# Altium project XP-Hardv.PrjPCB
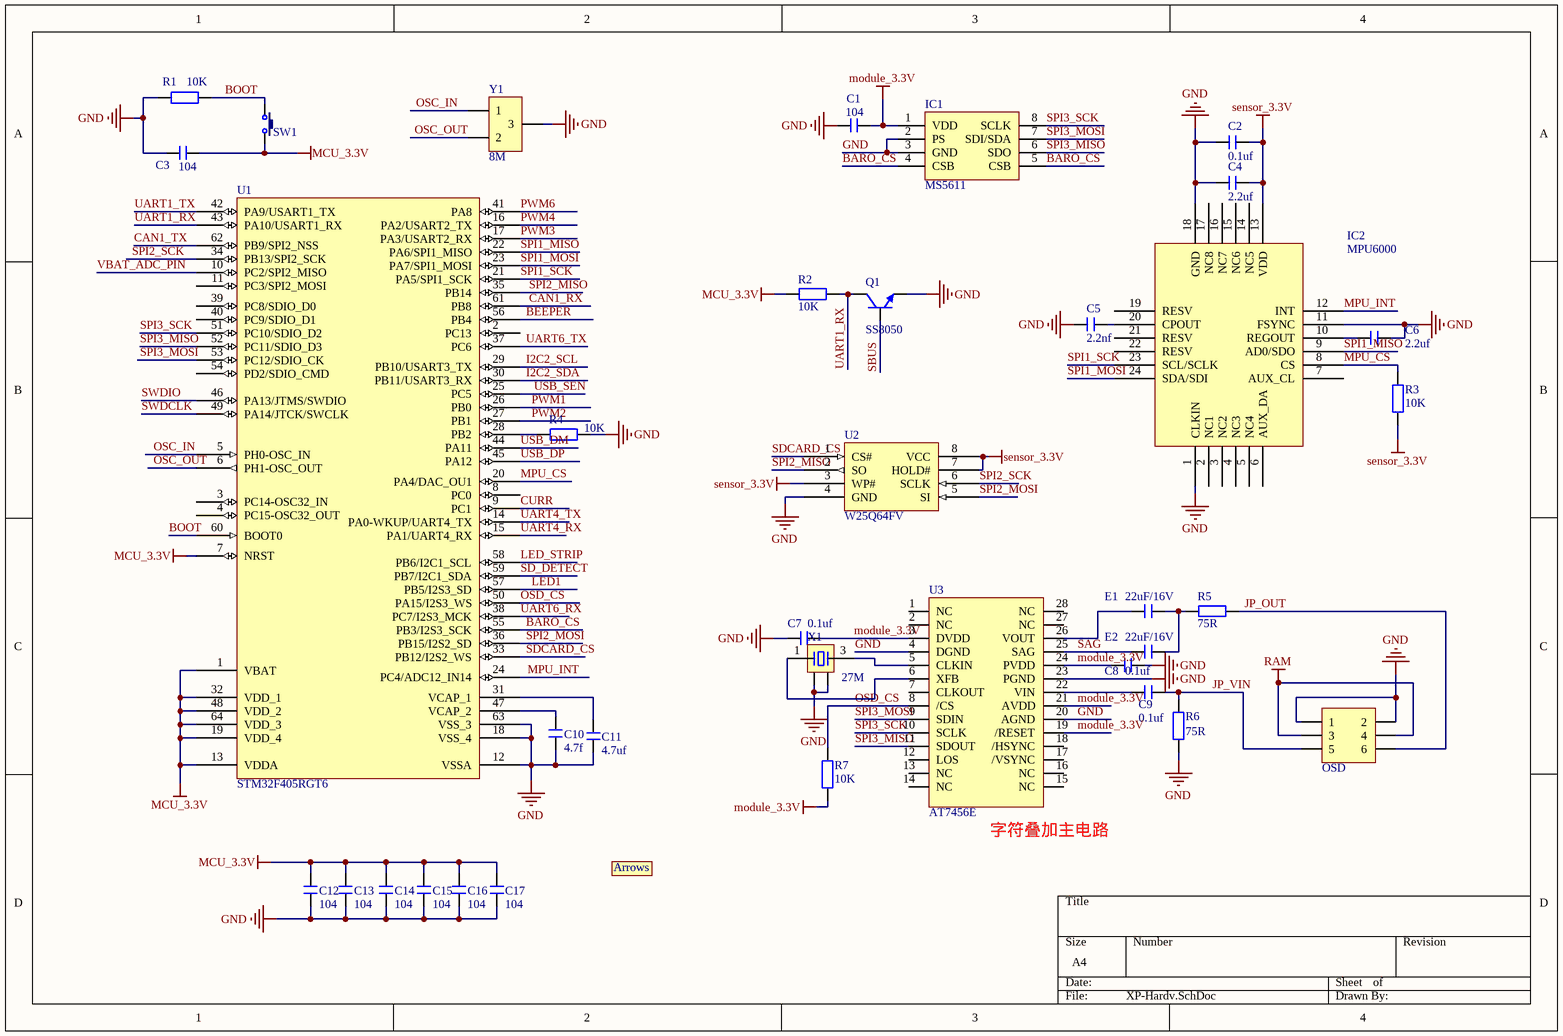
[diagram p0: XP-Hardv.SchDoc]
2 sheets, 87 parts. Net scope: global (net labels, ports and power ports of the same name join across sheets).
Board file: XP-Hardv.PcbDoc
Sheets:
  XP-Hardv.SchDoc
  XP-Hardv_PMU.SchDoc

## Sheet XP-Hardv.SchDoc
size A4

### Parts
C1  104  [C 0402_M]
C2  0.1uf  [C 0402_M]
C3  104  [C 0402_M]
C4  2.2uf  [C 0402_M]
C5  2.2nf  [C 0402_M]
C6  2.2uf  [C 0402_M]
C7  0.1uf  [C 0402_M]
C8  0.1uf  [C 0402_M]
C9  0.1uf  [C 0402_M]
C10  4.7f  [C 0402_M]
C11  4.7uf  [C 0402_M]
C12  104  [C 0402_M]
C13  104  [C 0402_M]
C14  104  [C 0402_M]
C15  104  [C 0402_M]
C16  104  [C 0402_M]
C17  104  [C 0402_M]
E1  22uF/16V  [C 0805_L]
E2  22uF/16V  [C 0805_L]
IC1  MS5611  [MS5611]
IC2  MPU6000  [MPU6050]
logo1  Arrows  [Arrows - E]  (value not drawn)
OSD  Header3X2  [PHD2.0-LI-2x3P]  (value not drawn)
Q1  SS8050  [SOT23-3M]
R1  10K  [R 0402_M]
R2  10K  [R 0402_M]
R3  10K  [R 0402_M]
R4  10K  [R 0402_M]
R5  75R  [R 0402_M]
R6  75R  [R 0402_M]
R7  10K  [R 0402_M]
SW1  3x6x5  [TSW 3*6*4.3-S-W]  (value not drawn)
U1  STM32F405RGT6  [LQFP64 10x10_N]
U2  W25Q64FV  [Q-WSON8_6x5]
U3  AT7456E  [AT7456E - B]
X1  27M  [OSC 3225-4P]
Y1  8M  [L - CSTCE-3213]

### Nets
CAN1_RX: U1.61(PB8)
CAN1_TX: U1.62(PB9/SPI2_NSS)
GND: C1.2 C2.2 C3.1 C4.2 C5.2 C6.1 C7.1 C8.2 C10.1 C11.1 C12.1 C13.1 C14.1 C15.1 C16.1 C17.1 IC1.2(PS) IC1.3(GND) IC2.1(CLKIN) IC2.11(FSYNC) IC2.18(GND) OSD.1 OSD.2 Q1.2(E) R1.2 R4.2 R6.1 U1.12(VSSA) U1.18(VSS_4) U1.63(VSS_3) U2.4(GND) U3.4(DGND) U3.20(AGND) U3.23(PGND) X1.2 X1.4 Y1.3
MCU_3.3V: C3.2 C12.2 C13.2 C14.2 C15.2 C16.2 C17.2 R2.2 SW1.2 U1.1(VBAT) U1.7(NRST) U1.13(VDDA) U1.19(VDD_4) U1.32(VDD_1) U1.48(VDD_2) U1.64(VDD_3)
module_3.3V: C1.1 C7.2 C8.1 IC1.1(VDD) R7.1 U3.3(DVDD) U3.19(/RESET) U3.21(AVDD) U3.24(PVDD)
RAM: OSD.3 OSD.4
sensor_3.3V: C2.1 C4.1 IC2.13(VDD) R3.1 U2.3(WP#) U2.7(HOLD#) U2.8(VCC)
BARO_CS: IC1.4(CSB) IC1.5(CSB) U1.55(PB3/I2S3_SCK)
BEEPER: U1.56(PB4)
BOOT: R1.1 SW1.1 U1.60(BOOT0)
CURR: U1.9(PC1)
I2C2_SCL: U1.29(PB10/USART3_TX)
I2C2_SDA: U1.30(PB11/USART3_RX)
JP_OUT: OSD.6 R5.2
JP_VIN: C9.2 OSD.5 R6.2
LED1: U1.57(PB5/I2S3_SD)
LED_STRIP: U1.58(PB6/I2C1_SCL)
MPU_CS: IC2.8(CS) R3.2 U1.20(PA4/DAC_OU1)
MPU_INT: IC2.12(INT) U1.24(PC4/ADC12_IN14)
OSC_IN: U1.5(PH0-OSC_IN) Y1.1
OSC_OUT: U1.6(PH1-OSC_OUT) Y1.2
OSD_CS: R7.2 U1.50(PA15/I2S3_WS) U3.8(/CS)
PWM1: U1.26(PB0)
PWM2: U1.27(PB1)
PWM3: U1.17(PA3/USART2_RX)
PWM4: U1.16(PA2/USART2_TX)
PWM6: U1.41(PA8)
SAG: E2.1 U3.25(SAG)
SBUS: Q1.1(B)
SD_DETECT: U1.59(PB7/I2C1_SDA)
SDCARD_CS: U1.33(PB12/I2S2_WS) U2.1(CS#)
SPI1_MISO: IC2.9(AD0/SDO) U1.22(PA6/SPI1_MISO)
SPI1_MOSI: IC2.24(SDA/SDI) U1.23(PA7/SPI1_MOSI)
SPI1_SCK: IC2.23(SCL/SCLK) U1.21(PA5/SPI1_SCK)
SPI2_MISO: U1.35(PB14) U2.2(SO)
SPI2_MOSI: U1.36(PB15/I2S2_SD) U2.5(SI)
SPI2_SCK: U1.34(PB13/SPI2_SCK) U2.6(SCLK)
SPI3_MISO: IC1.6(SDO) U1.52(PC11/SDIO_D3) U3.11(SDOUT)
SPI3_MOSI: IC1.7(SDI/SDA) U1.53(PC12/SDIO_CK) U3.9(SDIN)
SPI3_SCK: IC1.8(SCLK) U1.51(PC10/SDIO_D2) U3.10(SCLK)
SWDCLK: U1.49(PA14/JTCK/SWCLK)
SWDIO: U1.46(PA13/JTMS/SWDIO)
UART1_RX: Q1.3(C) R2.1 U1.43(PA10/USART1_RX)
UART1_TX: U1.42(PA9/USART1_TX)
UART4_RX: U1.15(PA1/UART4_RX)
UART4_TX: U1.14(PA0-WKUP/UART4_TX)
UART6_RX: U1.38(PC7/I2S3_MCK)
UART6_TX: U1.37(PC6)
USB_DM: U1.44(PA11)
USB_DP: U1.45(PA12)
USB_SEN: U1.25(PC5)
VBAT_ADC_PIN: U1.10(PC2/SPI2_MISO)
NetC5_1: C5.1 IC2.20(CPOUT)
NetC6_2: C6.2 IC2.10(REGOUT)
NetC9_1: C9.1 U3.22(VIN)
NetC10_2: C10.2 U1.47(VCAP_2)
NetC11_2: C11.2 U1.31(VCAP_1)
NetE1_1: E1.1 U3.26(VOUT)
NetE1_2: E1.2 E2.2 R5.1
NetR4_1: R4.1 U1.28(PB2)
NetU3_5: U3.5(CLKIN) X1.3
NetU3_6: U3.6(XFB) X1.1

Not connected (* = marked no-connect by the designer): IC2 2(NC1) 3(NC2) 4(NC3) 5(NC4) 6(AUX_DA) 7(AUX_CL) 14(NC5) 15(NC6) 16(NC7) 17(NC8) 19(RESV) 21(RESV) 22(RESV); U1 2(PC13) 3(PC14-OSC32_IN) 4(PC15-OSC32_OUT) 8(PC0) 11(PC3/SPI2_MOSI) 39(PC8/SDIO_D0) 40(PC9/SDIO_D1) 54(PD2/SDIO_CMD); U3 1(NC) 2(NC) 7(CLKOUT) 12(LOS) 13(NC) 14(NC) 15(NC) 16(NC) 17(/VSYNC) 18(/HSYNC) 27(NC) 28(NC)

### Notes on the sheet
- Labels drawn without touching a wire or pin: 字符叠加主电路

### Library data of the parts
C1-C17 E1 E2 = C: 无极性贴片电容; 版权归属: 源创客; BOM名称: 无极性贴片电容; 学习资源: www.ooocke.com
IC1 = MS5611: 气压传感器; 版权归属: 源创客; BOM名称: 气压传感器; 学习资源: www.ooocke.com
IC2 = MPU6000: 版权所有: 河池学院智能控制重点实验室; Library name: 传感器; 了解我们: http://www.jianshengdrlab.com
logo1 = Arrows: 名称: 箭头; 版权所有: 深圳市哈鸣科技有限公司; 说明: 无人机方向箭头
OSD = Header 3X2: 3*2P接插件; 版权归属: 源创客; BOM名称: 3*2P接插件; 学习资源: www.ooocke.com
Q1 = 8050-SMD: 高频放大-NPN型; 版权归属: 源创客; 属性: 40V 1.5A 1W 100MHZ; BOM名称: 高频放大-NPN型; 学习资源: www.ooocke.com
R1-R7 = R: 贴片电阻; 版权归属: 源创客; BOM名称: 贴片电阻; 学习资源: www.ooocke.com
SW1 = TSW 3x6: 3x6轻触开关; 版权归属: 源创客; BOM名称: 3x6轻触开关; 学习资源: www.ooocke.com
U1 = STM32F405RGT6: 32位STM单片机
U2 = W25Q64FV: 存储器芯片-64M
U3 = AT7456E: 版权所有: 河池学院智能控制重点实验室; Library name: 字符叠加芯片; 了解我们: http://www.jianshengdrlab.com
X1 = XTAL-4P: 4脚无源晶振; 版权归属: 源创客; BOM名称: 4脚无源晶振; 学习资源: www.ooocke.com
Y1 = CSTCE: BOM名称: 3脚无源晶振; 版权归属: Ly

## Sheet XP-Hardv_PMU.SchDoc
size A4
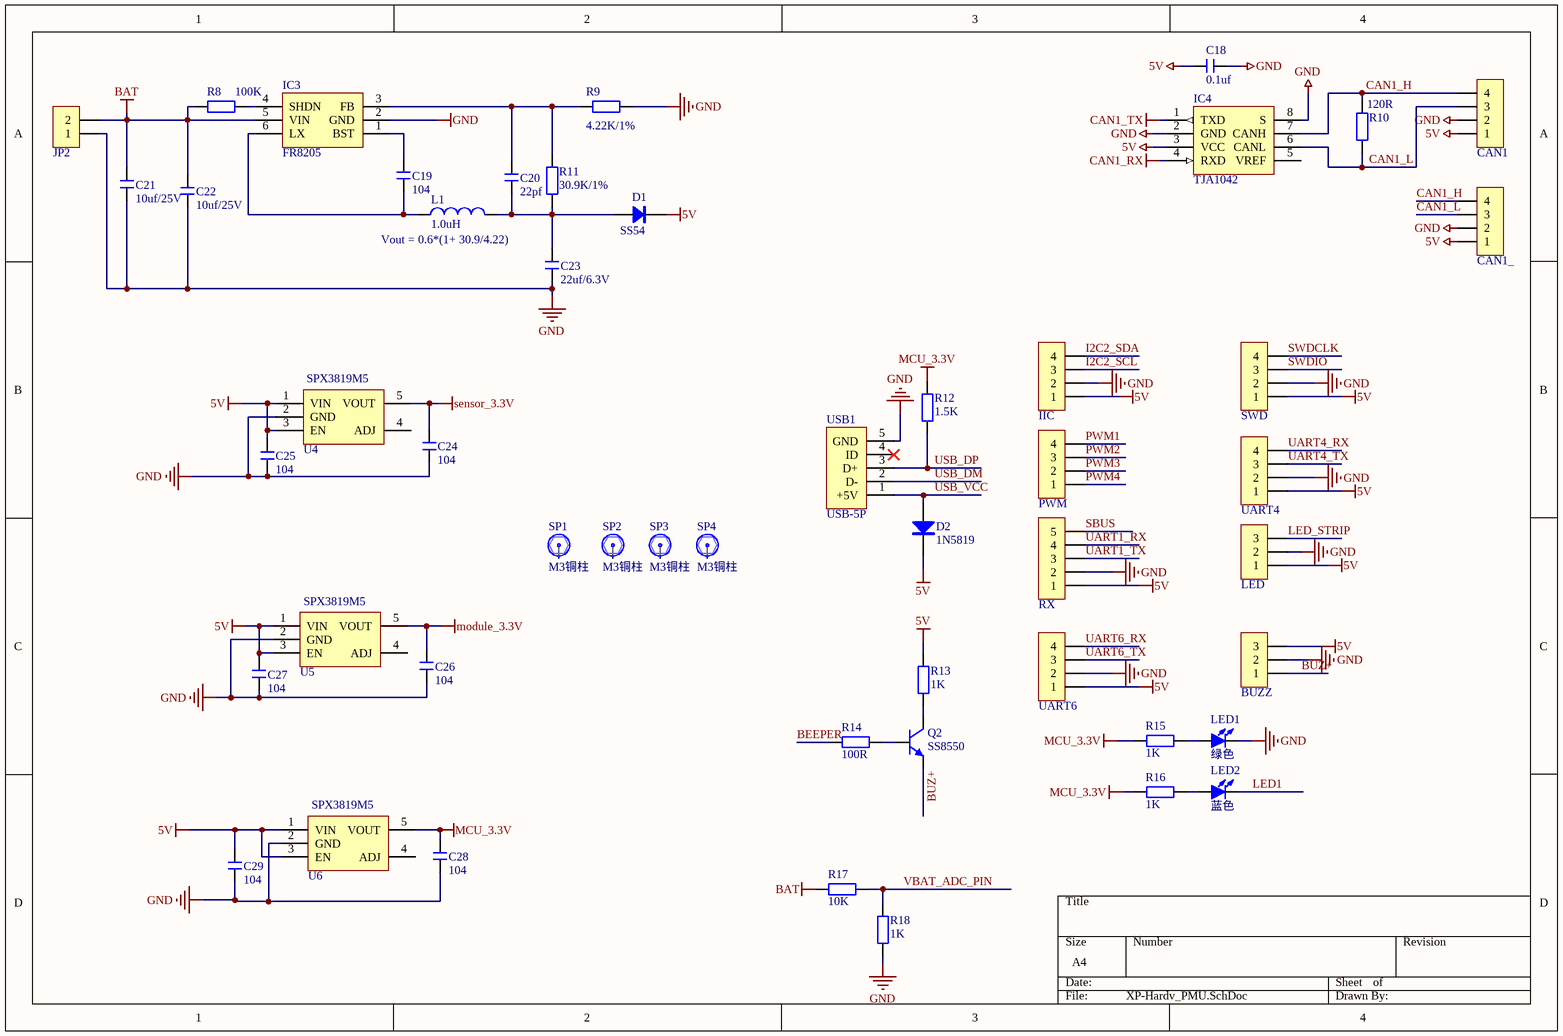
[diagram p1: XP-Hardv_PMU.SchDoc]

### Parts
BUZZ  Header 3  [SH1.00-WS-3P]  (value not drawn)
C18  0.1uf  [0402-C-1.6*0.5]
C19  104  [C 0402_M]
C20  22pf  [C 0402_M]
C21  10uf/25V  [C 0603_L]
C22  10uf/25V  [C 0603_L]
C23  22uf/6.3V  [C 0603_L]
C24  104  [C 0402_M]
C25  104  [C 0402_M]
C26  104  [C 0402_M]
C27  104  [C 0402_M]
C28  104  [C 0402_M]
C29  104  [C 0402_M]
CAN1  Header 4  [SH1.00-WS-4P]  (value not drawn)
CAN1_  Header 4  [SH1.00-WS-4P]  (value not drawn)
D1  SS54  [SMA]
D2  1N5819  [SOD-323]
IC3  FR8205  [SOT23-6L]
IC4  TJA1042  [L - HVSON - 8 - 3*3]
IIC  Header 4  [SH1.00-WS-4P]  (value not drawn)
JP2  HDR-1X2  [HDR2.54-LI-2P]  (value not drawn)
L1  1.0uH  [L - 7X7-F]
LED  Header 3  [SH1.00-WS-3P]  (value not drawn)
LED1  绿色  [LED 0603G]
LED2  蓝色  [LED 0603B]
PWM  Header 4  [SH1.00-WS-4P]  (value not drawn)
Q2  SS8550  [SOT23-3M]
R8  100K  [R 0402_M]
R9  4.22K/1%  [R 0402_M]
R10  120R  [0402-R-1.6*0.5]
R11  30.9K/1%  [R 0402_M]
R12  1.5K  [R 0402_M]
R13  1K  [R 0402_M]
R14  100R  [R 0402_M]
R15  1K  [R 0402_M]
R16  1K  [R 0402_M]
R17  10K  [R 0402_M]
R18  1K  [R 0402_M]
RX  Header 5  [SH1.00-WS-5P]  (value not drawn)
SP1  M3铜柱  [M3x4+6_L]
SP2  M3铜柱  [M3x4+6_L]
SP3  M3铜柱  [M3x4+6_L]
SP4  M3铜柱  [M3x4+6_L]
SWD  Header 4  [SH1.00-WS-4P]  (value not drawn)
U4  SPX3819M5  [L - SOT23-5L]
U5  SPX3819M5  [L - SOT23-5L]
U6  SPX3819M5  [L - SOT23-5L]
UART4  Header 4  [SH1.00-WS-4P]  (value not drawn)
UART6  Header 4  [SH1.00-WS-4P]  (value not drawn)
USB1  USB-5P  [USB-MICRO_D]

### Nets
5V: BUZZ.3 C18.1 C25.2 C27.2 C29.2 CAN1.1 CAN1_.1 D1.2(K) D2.2(K) IC4.3(VCC) IIC.1 LED.1 R13.2 RX.1 SWD.1 U4.1(VIN) U4.3(EN) U5.1(VIN) U5.3(EN) U6.1(VIN) U6.3(EN) UART4.1 UART6.1
BAT: C21.2 C22.2 IC3.5(VIN) JP2.2 R8.1 R17.1
CAN1_RX: IC4.4(RXD)
CAN1_TX: IC4.1(TXD)
GND: BUZZ.2 C18.2 C21.1 C22.1 C23.1 C24.1 C25.1 C26.1 C27.1 C28.1 C29.1 CAN1.2 CAN1_.2 IC3.2(GND) IC4.2(GND) IC4.8(S) IIC.2 JP2.1 LED.2 LED1.2(K) R9.2 R18.1 RX.2 SWD.2 U4.2(GND) U5.2(GND) U6.2(GND) UART4.2 UART6.2 USB1.5(GND)
MCU_3.3V: C28.2 R12.2 R15.2 R16.2 U6.5(VOUT)
module_3.3V: C26.2 U5.5(VOUT)
sensor_3.3V: C24.2 U4.5(VOUT)
BEEPER: R14.1
BUZ+: BUZZ.1 Q2.2(E)
CAN1_H: CAN1.4 CAN1_.4 IC4.7(CANH) R10.1
CAN1_L: CAN1.3 CAN1_.3 IC4.6(CANL) R10.2
I2C2_SCL: IIC.3
I2C2_SDA: IIC.4
LED1: LED2.2(K)
LED_STRIP: LED.3
PWM1: PWM.4
PWM2: PWM.3
PWM3: PWM.2
PWM4: PWM.1
SBUS: RX.5
SWDCLK: SWD.4
SWDIO: SWD.3
UART1_RX: RX.4
UART1_TX: RX.3
UART4_RX: UART4.4
UART4_TX: UART4.3
UART6_RX: UART6.4
UART6_TX: UART6.3
USB_DM: USB1.2(D-)
USB_DP: R12.1 USB1.3(D+)
USB_VCC: D2.1(A) USB1.1(+5V)
VBAT_ADC_PIN: R17.2 R18.2
NetC19_1: C19.1 IC3.6(LX) L1.1
NetC19_2: C19.2 IC3.1(BST)
NetC20_1: C20.1 IC3.3(FB) R9.1 R11.2
NetC20_2: C20.2 C23.2 D1.1(A) L1.2 R11.1
NetIC3_4: IC3.4(SHDN) R8.2
NetLED1_1: LED1.1(A) R15.1
NetLED2_1: LED2.1(A) R16.1
NetQ2_1: Q2.1(B) R14.2
NetQ2_3: Q2.3(C) R13.1

Not connected (* = marked no-connect by the designer): IC4 5(VREF); SP1 1; SP2 1; SP3 1; SP4 1; U4 4(ADJ); U5 4(ADJ); U6 4(ADJ); USB1 4(ID)*

### Notes on the sheet
- Vout = 0.6*(1+ 30.9/4.22)

### Library data of the parts
BUZZ LED = Header 3: 3P接插件; 版权所有: 河池学院智能控制重点实验室; 了解我们: http://www.jianshengdrlab.com; Library name: 3P接插件
C18 = C
C19-C23 = C: 无极性贴片电容; 版权归属: 源创客; 材质: X7R; BOM名称: 无极性贴片电容; 学习资源: www.ooocke.com
C24-C29 = C: 无极性贴片电容; 版权归属: 源创客; BOM名称: 无极性贴片电容; 学习资源: www.ooocke.com
CAN1 CAN1_ IIC PWM SWD UART4 UART6 = Header 4: 4P接插件; 版权所有: 河池学院智能控制重点实验室; 了解我们: http://www.jianshengdrlab.com; Library name: 4P接插件
D1 = SS54: 肖特基二极管; 版权归属: 源创客; 属性: 40V/3A; BOM名称: 肖特基二极管; 学习资源: www.ooocke.com
D2 = 1N5819: 肖特基二极管; 版权归属: 源创客; 属性: 40V/2A; BOM名称: 肖特基二极管; 学习资源: www.ooocke.com
IC3 = SX1308: 可调升压芯片; 版权归属: 源创客; BOM名称: 可调升压芯片; 学习资源: www.ooocke.com
IC4 = TJA1050: CAN总线收发芯片; 版权归属: 源创客; BOM名称: CAN总线收发芯片; 学习资源: www.ooocke.com
JP2 = Header 2: 2P接插件; 版权归属: 源创客; BOM名称: 2P接插件; 学习资源: www.ooocke.com
L1 = L
LED1 LED2 = LED-SMD: 贴片LED; 版权归属: 源创客; BOM名称: 贴片LED; 学习资源: www.ooocke.com
Q2 = 8050-SMD: as Q1 on sheet XP-Hardv; BOM名称: 高频放大-NPN型; 学习资源: www.ooocke.com
R8 R9 R11-R18 = R: 贴片电阻; 版权归属: 源创客; BOM名称: 贴片电阻; 学习资源: www.ooocke.com
R10 = R
RX = Header 5: 5P接插件; 版权所有: 河池学院智能控制重点实验室; 了解我们: http://www.jianshengdrlab.com; Library name: 5P接插件
SP1-SP4 = 铜柱加头小焊盘: 铜柱; 版权归属: 源创客; BOM名称: 铜柱; 学习资源: www.ooocke.com
U4-U6 = SPX3819M5: 元件名称: SPX3819M5稳压器; 版权所有: Ly
USB1 = USB-5P: 微型USB母座; 版权归属: 源创客; BOM名称: 微型USB母座; 学习资源: www.ooocke.com

## Nets that join several sheets
CAN1_RX: XP-Hardv (U1.61), XP-Hardv_PMU (IC4.4)
CAN1_TX: XP-Hardv (U1.62), XP-Hardv_PMU (IC4.1)
GND: XP-Hardv (37 pins), XP-Hardv_PMU (30 pins)
MCU_3.3V: XP-Hardv (16 pins), XP-Hardv_PMU (5 pins)
module_3.3V: XP-Hardv (9 pins), XP-Hardv_PMU (C26.2 U5.5)
sensor_3.3V: XP-Hardv (7 pins), XP-Hardv_PMU (C24.2 U4.5)
BEEPER: XP-Hardv (U1.56), XP-Hardv_PMU (R14.1)
I2C2_SCL: XP-Hardv (U1.29), XP-Hardv_PMU (IIC.3)
I2C2_SDA: XP-Hardv (U1.30), XP-Hardv_PMU (IIC.4)
LED1: XP-Hardv (U1.57), XP-Hardv_PMU (LED2.2)
LED_STRIP: XP-Hardv (U1.58), XP-Hardv_PMU (LED.3)
PWM1: XP-Hardv (U1.26), XP-Hardv_PMU (PWM.4)
PWM2: XP-Hardv (U1.27), XP-Hardv_PMU (PWM.3)
PWM3: XP-Hardv (U1.17), XP-Hardv_PMU (PWM.2)
PWM4: XP-Hardv (U1.16), XP-Hardv_PMU (PWM.1)
SBUS: XP-Hardv (Q1.1), XP-Hardv_PMU (RX.5)
SWDCLK: XP-Hardv (U1.49), XP-Hardv_PMU (SWD.4)
SWDIO: XP-Hardv (U1.46), XP-Hardv_PMU (SWD.3)
UART1_RX: XP-Hardv (Q1.3 R2.1 U1.43), XP-Hardv_PMU (RX.4)
UART1_TX: XP-Hardv (U1.42), XP-Hardv_PMU (RX.3)
UART4_RX: XP-Hardv (U1.15), XP-Hardv_PMU (UART4.4)
UART4_TX: XP-Hardv (U1.14), XP-Hardv_PMU (UART4.3)
UART6_RX: XP-Hardv (U1.38), XP-Hardv_PMU (UART6.4)
UART6_TX: XP-Hardv (U1.37), XP-Hardv_PMU (UART6.3)
USB_DM: XP-Hardv (U1.44), XP-Hardv_PMU (USB1.2)
USB_DP: XP-Hardv (U1.45), XP-Hardv_PMU (R12.1 USB1.3)
VBAT_ADC_PIN: XP-Hardv (U1.10), XP-Hardv_PMU (R17.2 R18.2)